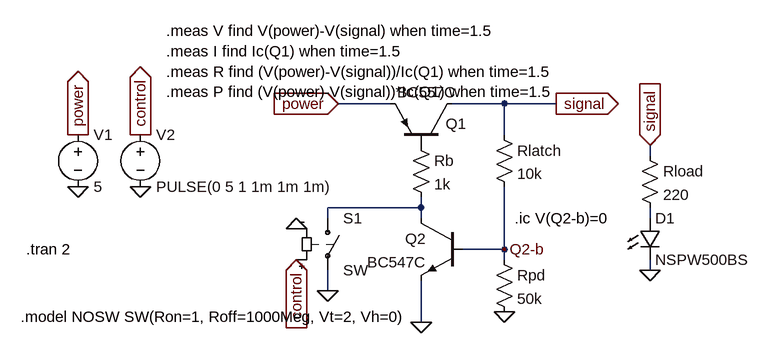
[diagram p0: schematic latch-npn-pnp.asc]
latch-npn-pnp.asc, the LTspice schematic file:
Version 4
SHEET 1 1184 680
WIRE 464 112 384 112
WIRE 640 112 560 112
WIRE 720 112 640 112
WIRE 640 160 640 112
WIRE 864 192 864 176
WIRE 512 272 512 256
WIRE 512 272 368 272
WIRE 368 288 368 272
WIRE 512 288 512 272
WIRE 864 288 864 272
WIRE 640 336 640 240
WIRE 640 336 576 336
WIRE 640 352 640 336
WIRE 864 368 864 352
WIRE 368 400 368 368
WIRE 512 448 512 384
FLAG 512 448 0
FLAG 384 112 power
IOPIN 384 112 In
FLAG 720 112 signal
IOPIN 720 112 Out
FLAG 864 368 0
FLAG 864 176 signal
IOPIN 864 176 In
FLAG -16 240 0
FLAG -16 160 power
IOPIN -16 160 Out
FLAG 80 240 0
FLAG 80 160 control
IOPIN 80 160 Out
FLAG 320 352 control
IOPIN 320 352 In
FLAG 320 304 0
FLAG 640 336 Q2-b
FLAG 368 400 0
FLAG 640 432 0
SYMBOL pnp 560 176 M270
WINDOW 0 33 10 VLeft 2
WINDOW 3 82 85 VLeft 2
SYMATTR InstName Q1
SYMATTR Value BC557C
SYMBOL npn 576 288 M0
SYMATTR InstName Q2
SYMATTR Value BC547C
SYMBOL Res 624 144 R0
SYMATTR InstName Rlatch
SYMATTR Value 10k
SYMBOL Res 848 176 R0
SYMATTR InstName Rload
SYMATTR Value 220
SYMBOL Voltage -16 144 R0
SYMATTR InstName V1
SYMATTR Value 5
SYMBOL Voltage 80 144 R0
SYMATTR InstName V2
SYMATTR Value PULSE(0 5 1 1m 1m 1m)
SYMBOL sw 368 272 R0
SYMATTR InstName S1
SYMATTR SpiceModel NOSW
SYMBOL Res 496 160 R0
SYMATTR InstName Rb
SYMATTR Value 1k
SYMBOL LED 848 288 R0
SYMATTR InstName D1
SYMATTR Value NSPW500BS
SYMATTR Description Diode
SYMATTR Type diode
SYMBOL Res 624 336 R0
SYMATTR InstName Rpd
SYMATTR Value 50k
TEXT -104 440 Left 2 !.model NOSW SW(Ron=1, Roff=1000Meg, Vt=2, Vh=0)
TEXT -96 336 Left 2 !.tran 2
TEXT 656 288 Left 2 !.ic V(Q2-b)=0
TEXT 120 0 Left 2 !.meas V find V(power)-V(signal) when time=1.5\n.meas I find Ic(Q1) when time=1.5\n.meas R find (V(power)-V(signal))/Ic(Q1) when time=1.5\n.meas P find (V(power)-V(signal))*Ic(Q1) when time=1.5

The netlist it stands for:
* latch-npn-pnp.asc
Q1 signal P001 power 0 BC557C
Q2 N001 Q2-b 0 0 BC547C
Rlatch signal Q2-b 10k
Rload signal N002 220
V1 power 0 5
V2 control 0 PULSE(0 5 1 1m 1m 1m)
S1 N001 0 control 0 NOSW SW
Rb P001 N001 1k
D1 N002 0 NSPW500BS
Rpd Q2-b 0 50k
.model D D
.lib standard.dio
.model NPN NPN
.model PNP PNP
.lib standard.bjt
.model NOSW SW(Ron=1, Roff=1000Meg, Vt=2, Vh=0)
.tran 2
.ic V(Q2-b)=0
.meas V find V(power)-V(signal) when time=1.5
.meas I find Ic(Q1) when time=1.5
.meas R find (V(power)-V(signal))/Ic(Q1) when time=1.5
.meas P find (V(power)-V(signal))*Ic(Q1) when time=1.5
.backanno
.end